# EasyEDA schematic Circuit diagram.json
TITLE: LoRa Module; REV: 1.0; Date: 2025-04-10; Sheet: 1/1; Drawn By: aashiawasthi2; Company: MMMUT
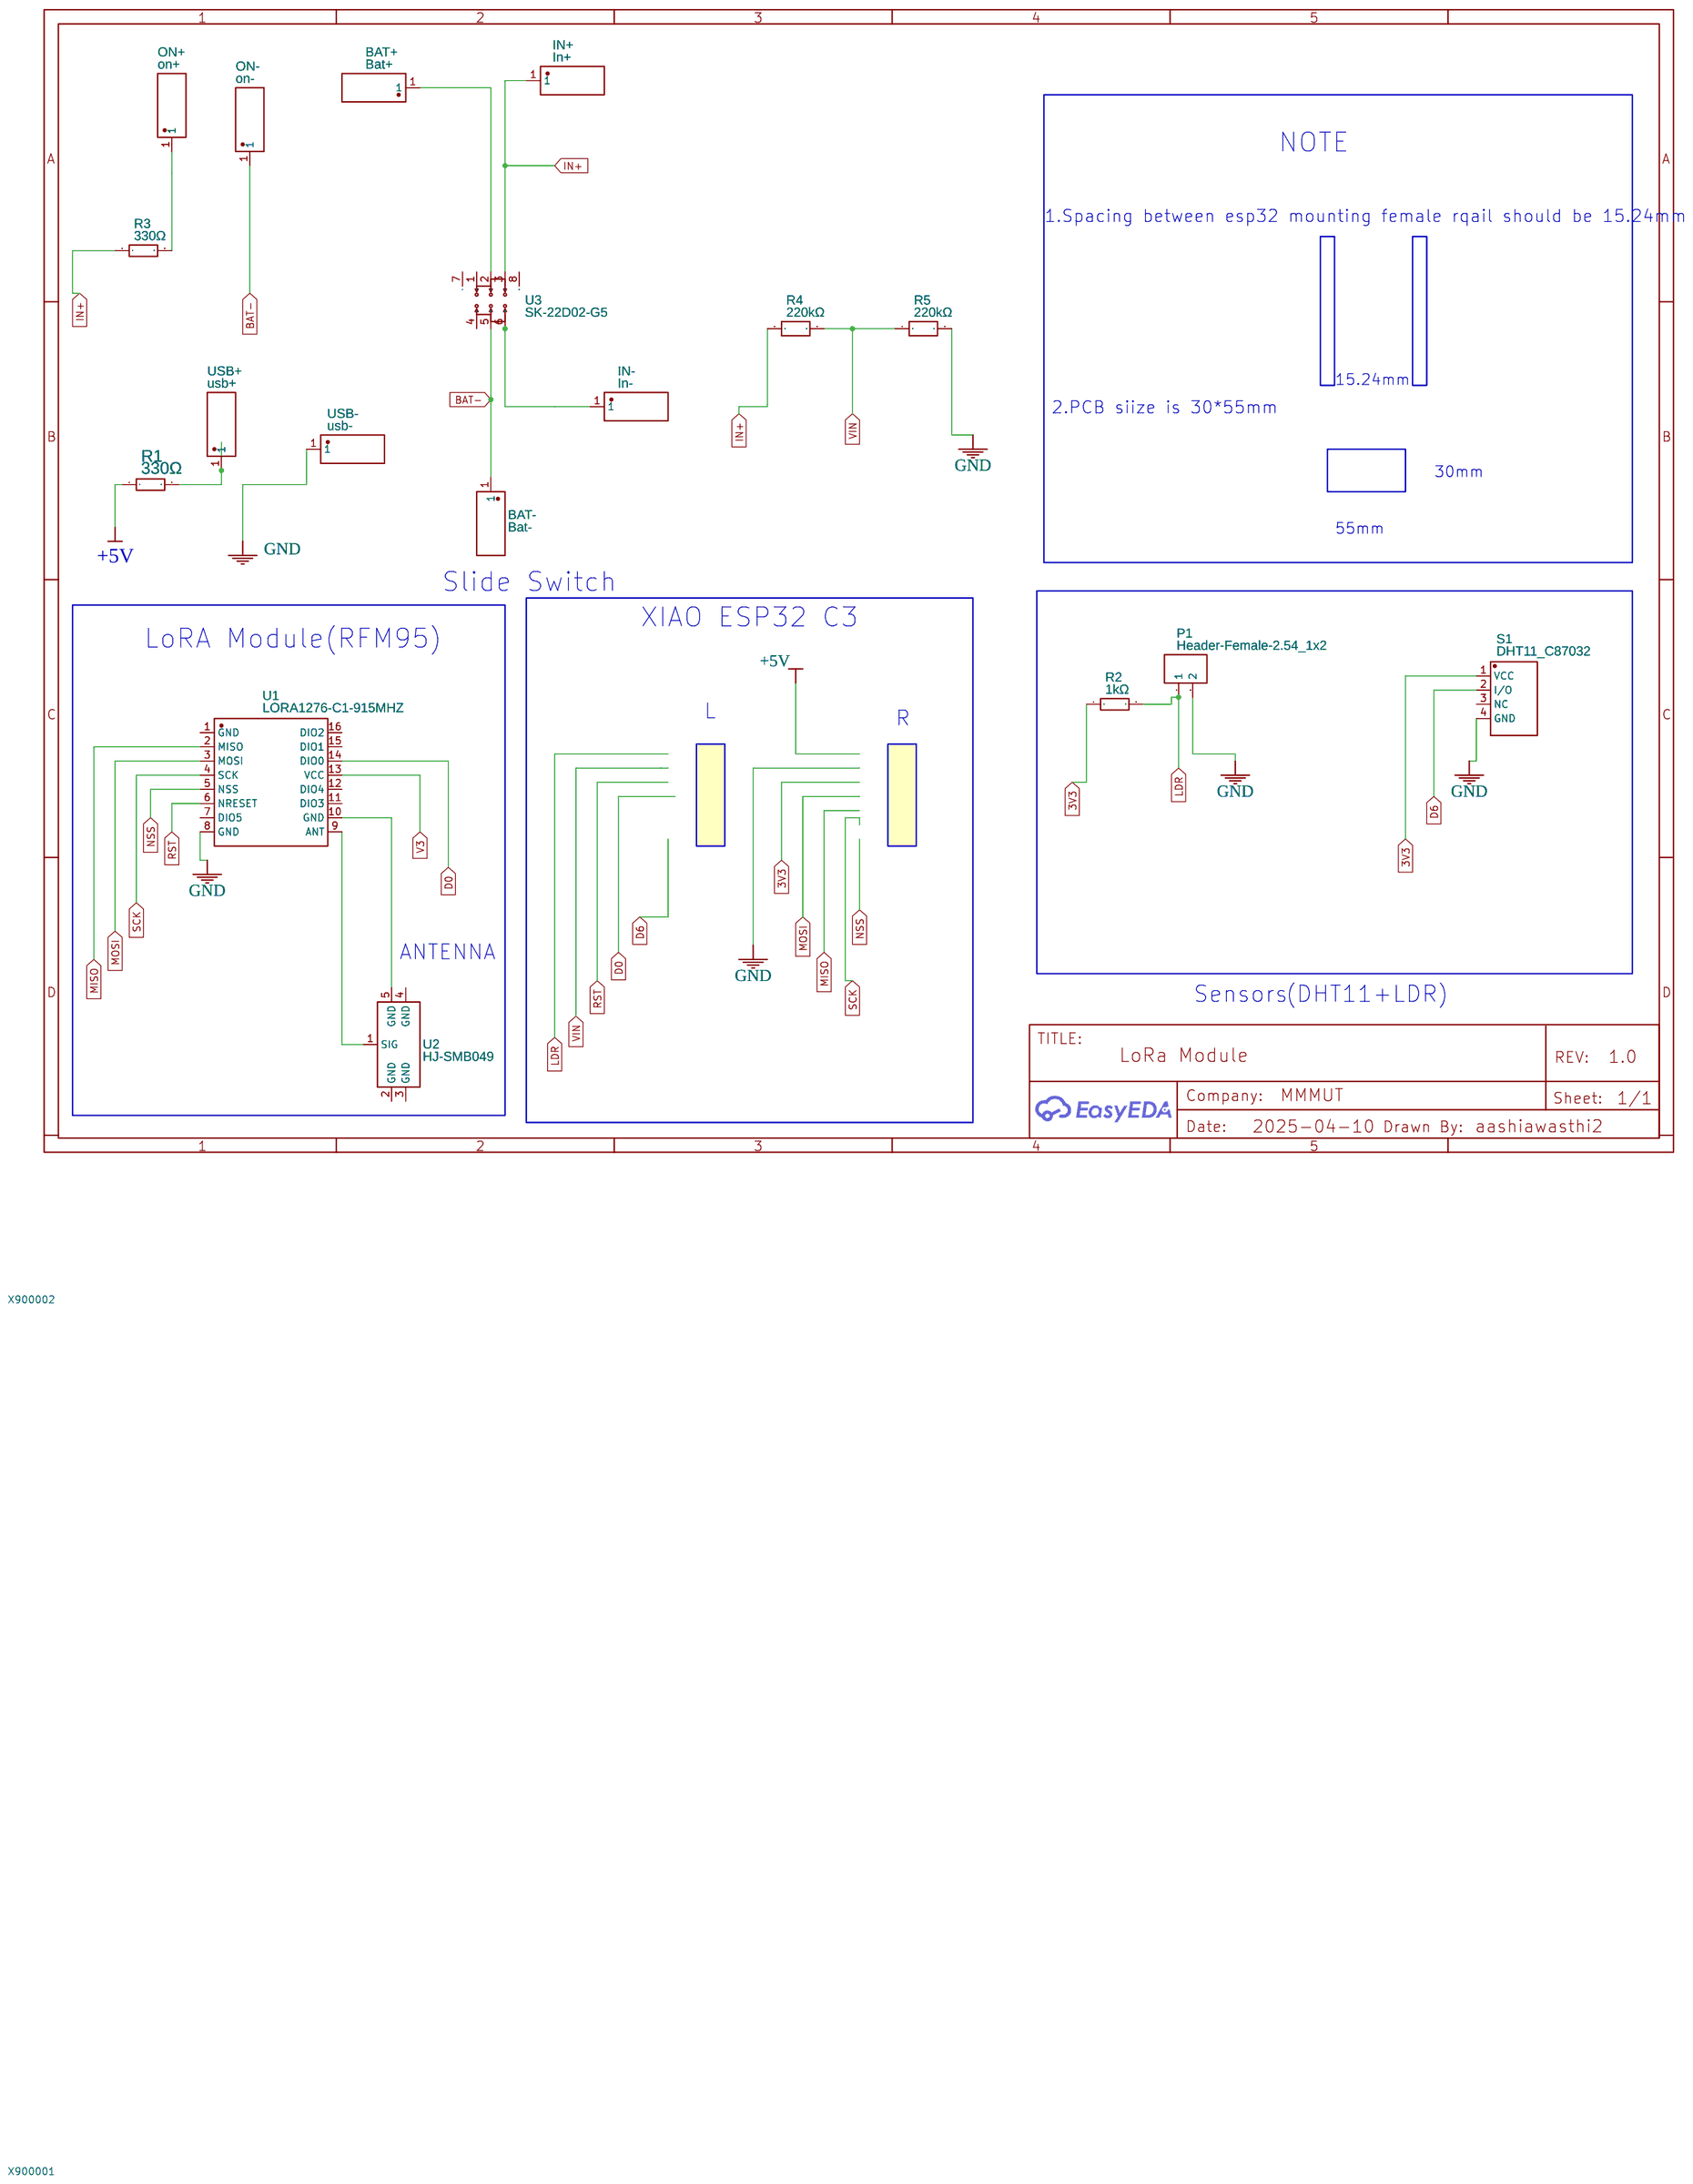
[diagram p0: schematic sheet]

## Parts
#1  ESP32C3_L
#2  ESP32C3_R
BAT+  Bat+  [FL_001]
BAT-  Bat-  [FL_001]
IN+  In+  [FL_001]
IN-  In-  [FL_001]
ON+  on+  [FL_001]
ON-  on-  [FL_001]
P1  Header-Female-2.54_1x2  [HDR-TH_2P-P2.54-V-F]
R1  330Ω  [R1206]
R2  1kΩ  [R0402]
R3  330Ω  [R0201]
R4  220kΩ  [R0402]
R5  220kΩ  [R0402]
S1  DHT11_C87032  [SENSOR-TH_DHT11-1]
U1  LORA1276-C1-915MHZ  [COMM-SMD_LORA1276-C1-915MHZ]
U2  HJ-SMB049  [SMA-TH_HJ-SMA015]
U3  SK-22D02-G5  [SW-TH_DEALON_SK-22D02-G5]
USB+  usb+  [FL_001]
USB-  usb-  [FL_001]

## Library data of the parts
BAT+ BAT- IN+ IN- ON+ ON- USB+ USB- = DB-8-6BS9: Contributor: LCSC; Supplier: LCSC; Supplier Part: C2885803; Manufacturer: HCTL(华灿天禄); JLCPCB Part Class: Extended Part
P1 = Header-Female-2.54_1x2: Supplier: LCSC; Manufacturer: BOOMELE(博穆精密); Manufacturer Part: 2.54-1*2P母; Supplier Part: C49661; JLCPCB Part Class: Extended Part
R1 = CR1206J40331G: Supplier: LCSC; Manufacturer: LIZ(丽智电子); Supplier Part: C102333; JLCPCB Part Class: Extended Part
R2 = CR0402JF0102G: Supplier: LCSC; Manufacturer: LIZ(丽智电子); Supplier Part: C100571; JLCPCB Part Class: Extended Part
R3 = 0201WMJ0331TCE: Supplier: LCSC; Manufacturer: UNI-ROYAL(厚声); Supplier Part: C25064; JLCPCB Part Class: Extended Part
R4 R5 = CQ02WGF2203TCE: Contributor: LCSC; Supplier: LCSC; Supplier Part: C966834; Manufacturer: UNI-ROYAL(厚声); JLCPCB Part Class: Extended Part
S1 = DHT11_C87032: Supplier Part: C87032; Supplier: LCSC; Manufacturer: AOSONG; Manufacturer Part: DHT11; JLCPCB Part Class: Extended Part
U1 = LORA1276-C1-915MHZ: Contributor: lcsc; Supplier: LCSC; Supplier Part: C3001531; Manufacturer: G-NiceRF(思为无线); Manufacturer Part: lora1276-C1-915MHz; JLCPCB Part Class: Extended Part
U2 = HJ-SMB049: Supplier: LCSC; Supplier Part: C6321925; Manufacturer: 皇捷; Contributor: lcsc; JLCPCB Part Class: Extended Part
U3 = SK-22D02-G5: Contributor: lcsc; Supplier: LCSC; Supplier Part: C7424918; Manufacturer: DEALON(德艺隆); JLCPCB Part Class: Extended Part

## Nets
3V3: R2.1 S1.1(VCC)
+5V: R1.1
GND: P1.2 R5.2 S1.4(GND) U1.8(GND) USB-.1
V3: U1.13(VCC)
VIN: R4.2 R5.1
BAT-: BAT-.1 ON-.1 U3.5
D0: U1.14(DIO0)
D6: S1.2(I/O)
IN+: IN+.1 R3.1 R4.1 U3.3
LDR: P1.1 R2.2
MISO: U1.2(MISO)
MOSI: U1.3(MOSI)
NSS: U1.5(NSS)
RST: U1.6(NRESET)
SCK: U1.4(SCK)
Net-(BAT+-1): BAT+.1 U3.2
Net-(IN--1): IN-.1 U3.6
Net-(ON+-1): ON+.1 R3.2
Net-(R1-2): R1.2 USB+.1
Net-(U1-9): U1.9(ANT) U2.1(SIG)
Net-(U1-10): U1.10(GND) U2.5(GND)

Not connected (* = marked no-connect by the designer): S1 3(NC); U1 1(GND) 7(DIO5) 11(DIO3) 12(DIO4) 15(DIO1) 16(DIO2); U2 2(GND) 3(GND) 4(GND); U3 1 4 7 8

## Notes on the sheet
- NOTE
- 1.Spacing between esp32 mounting female rqail should be 15.24mm
- 15.24mm
- 2.PCB siize is 30*55mm
- 30mm
- 55mm
- Slide Switch
- XIAO ESP32 C3
- LoRA Module(RFM95)
- L
- R
- ANTENNA
- Sensors
- (DHT11+LDR)
